# EAGLE design esparducam-v2 (EAGLE 6.5.0)
CNAME: A two component webcam; CREVISION: 2; DESIGNER: Johan Kanflo
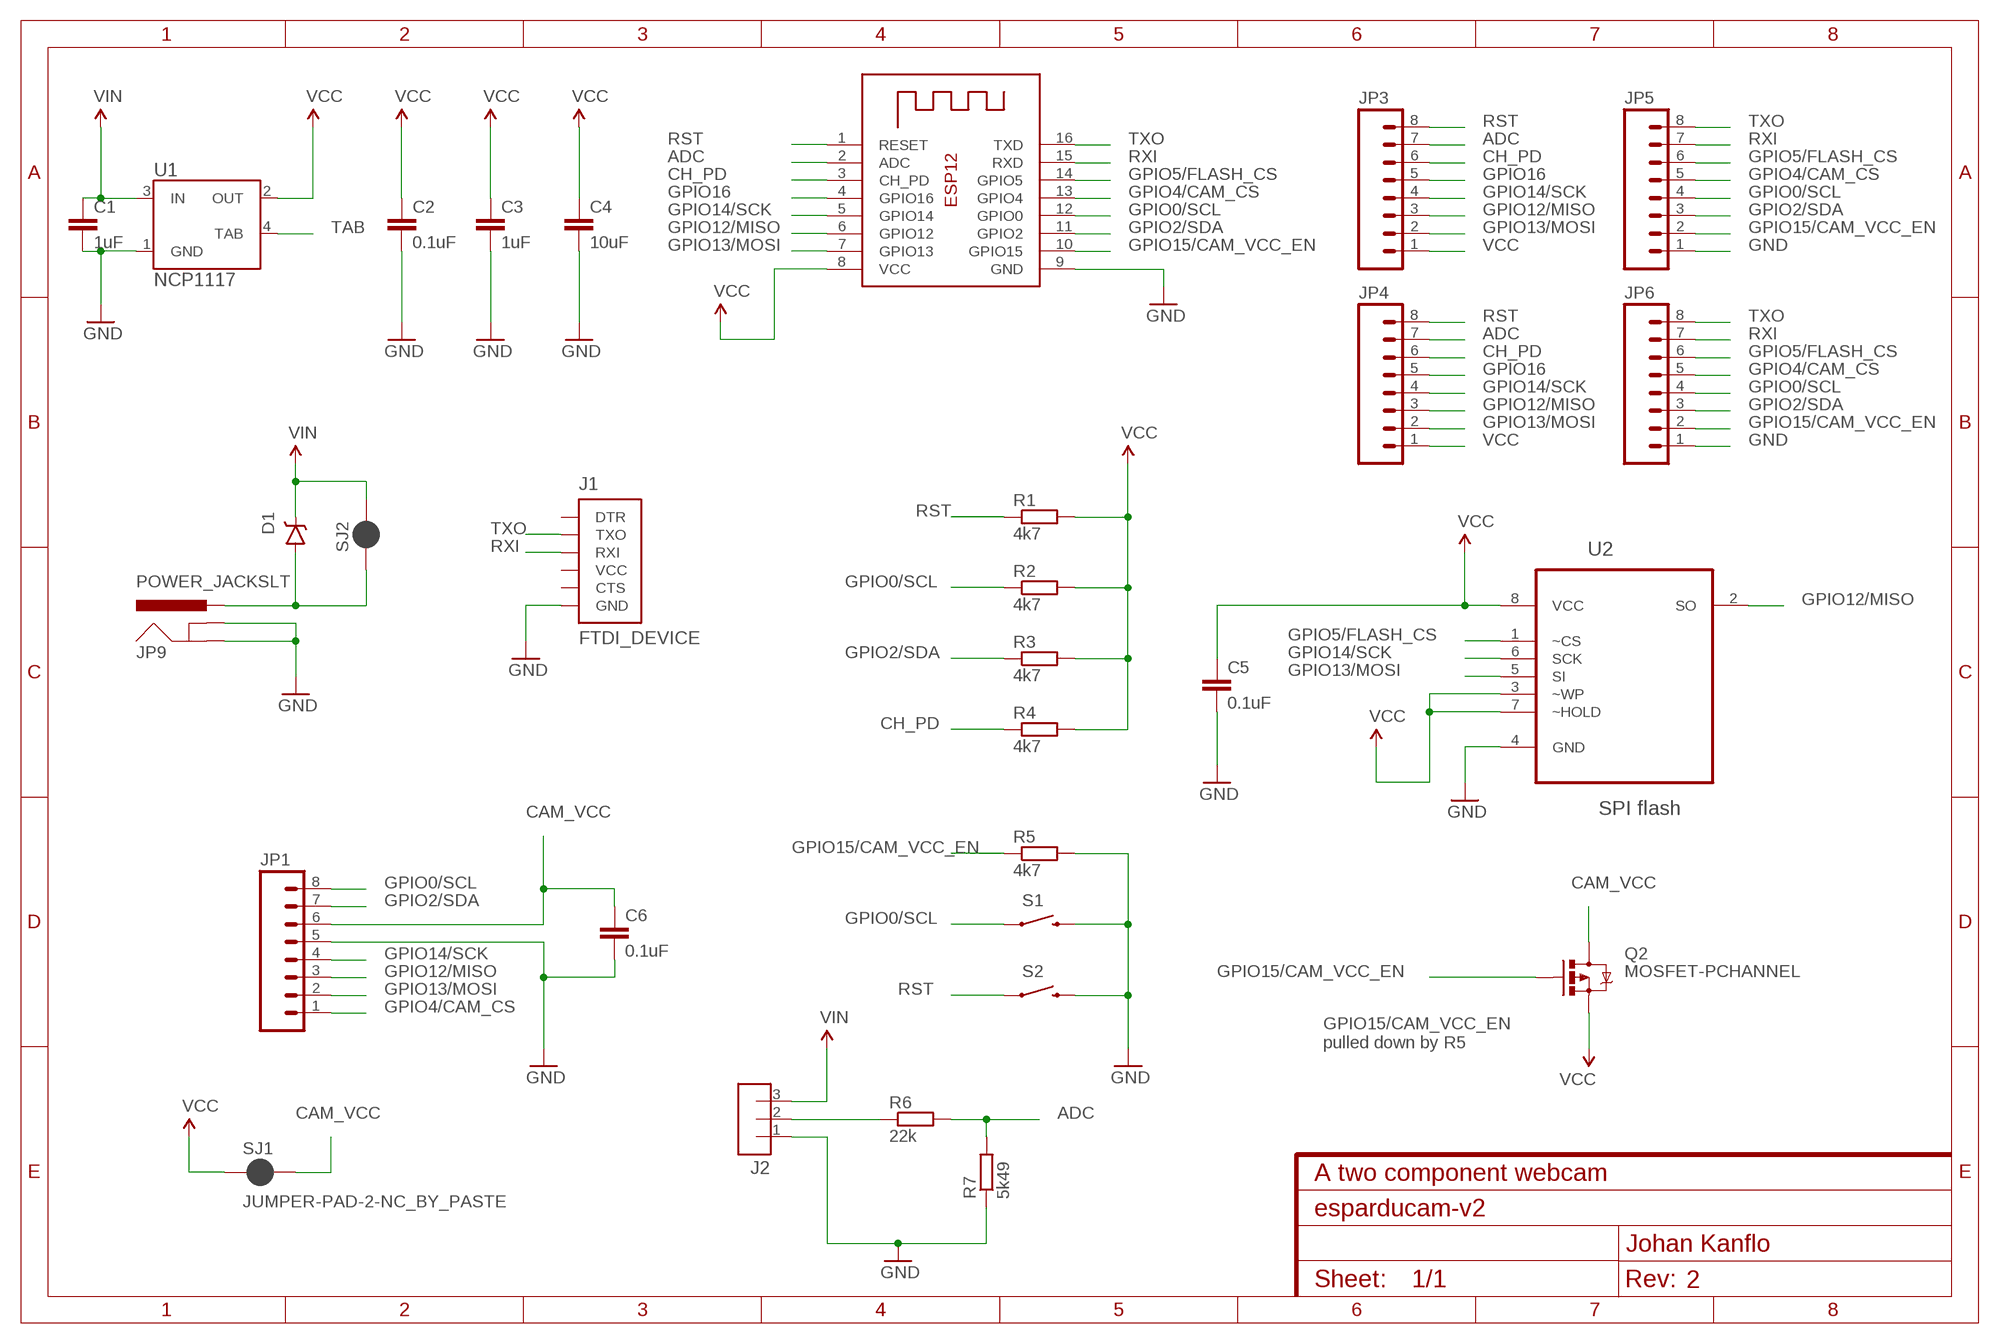
[diagram p0: schematic, sheet 1]

## Parts
C1  1uF  CAP0603-CAP  [0603-CAP]
C2  0.1uF  CAP0603-CAP  [0603-CAP]
C3  1uF  CAP0603-CAP  [0603-CAP]
C4  10uF  CAP0603-CAP  [0603-CAP]
C5  0.1uF  CAP0603-CAP  [0603-CAP]
C6  0.1uF  CAP0603-CAP  [0603-CAP]
D1  DIODE-SCHOTTKYSOD-123FL  [SOD-123FL]
J1  FTDI_DEVICE  [FTDI]
J2  JST_ZH_3PIN  [JST_ZH_3PIN]
JP1  M08  [1X08_ROUND]
JP3  M08  [1X08_ROUND]
JP4  M08  [1X08_ROUND]
JP5  M08  [1X08_ROUND]
JP6  M08  [1X08_ROUND]
JP9  POWER_JACKSLT  [POWER_JACK_SLOT]
Q2  MOSFET-PCHANNEL  [SOT23-3]
R1  4k7  R-EU_R0603  [R0603]
R2  4k7  R-EU_R0603  [R0603]
R3  4k7  R-EU_R0603  [R0603]
R4  4k7  R-EU_R0603  [R0603]
R5  4k7  R-EU_R0603  [R0603]
R6  22k  R-EU_R0603  [R0603]
R7  5k49  R-EU_R0603  [R0603]
S1  SWITCH-MOMENTARY-2SMD-1101NE  [TACTILE-SWITCH-1101NE]
S2  SWITCH-MOMENTARY-2SMD-1101NE  [TACTILE-SWITCH-1101NE]
SJ1  JUMPER-PAD-2-NC_BY_PASTE  [PAD-JUMPER-2-NC_BY_PASTE_YES_SILK]
SJ2  JUMPER-PAD-2-NC_BY_PASTE  [PAD-JUMPER-2-NC_BY_PASTE_YES_SILK]
U1  NCP1117  [SOT223]
U2  SPI flash  AT25DF021-SSH-B  [SOIC127P600X175-8N]
X1  ESP-12  [ESP-12]

## Nets
ADC: JP3.7 JP4.7 R6.2 R7.2 X1.2(ADC)
CAM_VCC: C6.1 JP1.6 Q2.3(D) SJ1.2
CH_PD: JP3.6 JP4.6 R4.1 X1.3(CH_PD)
GND: C1.2 C2.2 C3.2 C4.2 C5.2 C6.2 J1.GND J2.1 JP1.5 JP5.1 JP6.1 JP9.GND@1(GNDBREAK) JP9.GND@2(GND) R5.2 R7.1 S1.2 S2.2 U1.1(GND) U2.4(GND) X1.9(GND)
GPIO0/SCL: JP1.8 JP5.4 JP6.4 R2.1 S1.1 X1.12(GPIO0)
GPIO2/SDA: JP1.7 JP5.3 JP6.3 R3.1 X1.11(GPIO2)
GPIO4/CAM_CS: JP1.1 JP5.5 JP6.5 X1.13(GPIO4)
GPIO5/FLASH_CS: JP5.6 JP6.6 U2.1(~CS) X1.14(GPIO5)
GPIO12/MISO: JP1.3 JP3.3 JP4.3 U2.2(SO) X1.6(GPIO12)
GPIO13/MOSI: JP1.2 JP3.2 JP4.2 U2.5(SI) X1.7(GPIO13)
GPIO14/SCK: JP1.4 JP3.4 JP4.4 U2.6(SCK) X1.5(GPIO14)
GPIO15/CAM_VCC_EN: JP5.2 JP6.2 Q2.1(G) R5.1 X1.10(GPIO15)
GPIO16: JP3.5 JP4.5 X1.4(GPIO16)
N$1: J2.2 R6.1
N$2: D1.A JP9.PWR SJ2.1
RST: JP3.8 JP4.8 R1.1 S2.1 X1.1(RESET)
RXI: J1.RXI JP5.7 JP6.7 X1.15(RXD)
TAB: U1.4(TAB)
TXO: J1.TXO JP5.8 JP6.8 X1.16(TXD)
VCC: C2.1 C3.1 C4.1 C5.1 JP3.1 JP4.1 Q2.2(S) R1.2 R2.2 R3.2 R4.2 SJ1.1 U1.2(OUT) U2.3(~WP) U2.7(~HOLD) U2.8(VCC) X1.8(VCC)
VIN: C1.1 D1.C J2.3 SJ2.2 U1.3(IN)
Unconnected: J1.CTS J1.DTR J1.VCC

## Notes on the sheet
- GPIO15/CAM_VCC_EN
  pulled down by R5

## Library data of the parts
C1-C6 = SparkFun-Capacitors:CAP: Capacitor Standard 0603 ceramic capacitor, and 0.1" leaded capacitor.
D1 = kanflo:DIODE-SCHOTTKY
J1 = kanflo:FTDI_DEVICE: FTDI connector, device side This connector mates with an FTDI adapter using a straight ribbon cable.
J2 = kanflo:JST_ZH_3PIN: JST ZH connector, 3 pin ZH has 1.5mm spacing. Datasheet <http://www.jst-mfg.com/product/pdf/eng/eZH.pdf>
JP1 JP3-JP6 = SparkFun-Connectors:M08: Header 8 Standard 8-pin 0.1" header. Use with straight break away headers (SKU : PRT-00116), right angle break away headers (PRT-00553), swiss pins (PRT-00743), machine pins (PRT-00117), and female headers (PRT-00115).
JP9 = kanflo:POWER_JACK: Power Jack This is the standard 5.5mm barrel jack for power. The SLT footprint has been proven in designs produced by DirtyPCBs.com and only works if the mill layer is transmitted to the PCB fab house and the fab house accepts it. Rumours has it OSH Park accepts this design too. This symbol is meant for the cheap PCB mount connectors you find on eBay, retailing at less than 2EUR/10pcs (search for "dc power jack 5.5 2.1 pcb"). The difference between these and the ones sold by eg. SparkFun is the location of the pads relative to the plastic body.
Q2 = SparkFun-DiscreteSemi:MOSFET-PCHANNEL: Generic PMOSFET IRLML2244 - TRANS-11153 (SOT-23 -20V -4.3A) (1.Gate 2.Source 3.Drain) FQP27P06 - COM-10349 <http://www.sparkfun.com/products/10349> (TO-220 -60V -27A) (1.Gate 2.Source 3.Drain); PROD_ID: TRANS-08285
R1-R7 = resistor:R-EU_: RESISTOR, European symbol
S1 S2 = SparkFun-Electromechanical:SWITCH-MOMENTARY-2: Various NO switches- pushbuttons, reed, etc; PROD_ID: SWCH-00815
SJ1 SJ2 = SparkFun-Passives:JUMPER-PAD-2-NC_BY_PASTE
U1 = ELL-i-PowerIC:NCP1117
U2 = Atmel_By_element14_Batch_1-00:AT25DF021-SSH-B: 2-Megabit Minimum SPI Serial Flash Memory; MPN: AT25DF021-SSH-B; OC_FARNELL: 1715438; OC_NEWARK: 15R0303; PACKAGE: SOIC-8; SUPPLIER: Atmel
X1 = adafruit:ESP-12

## Board
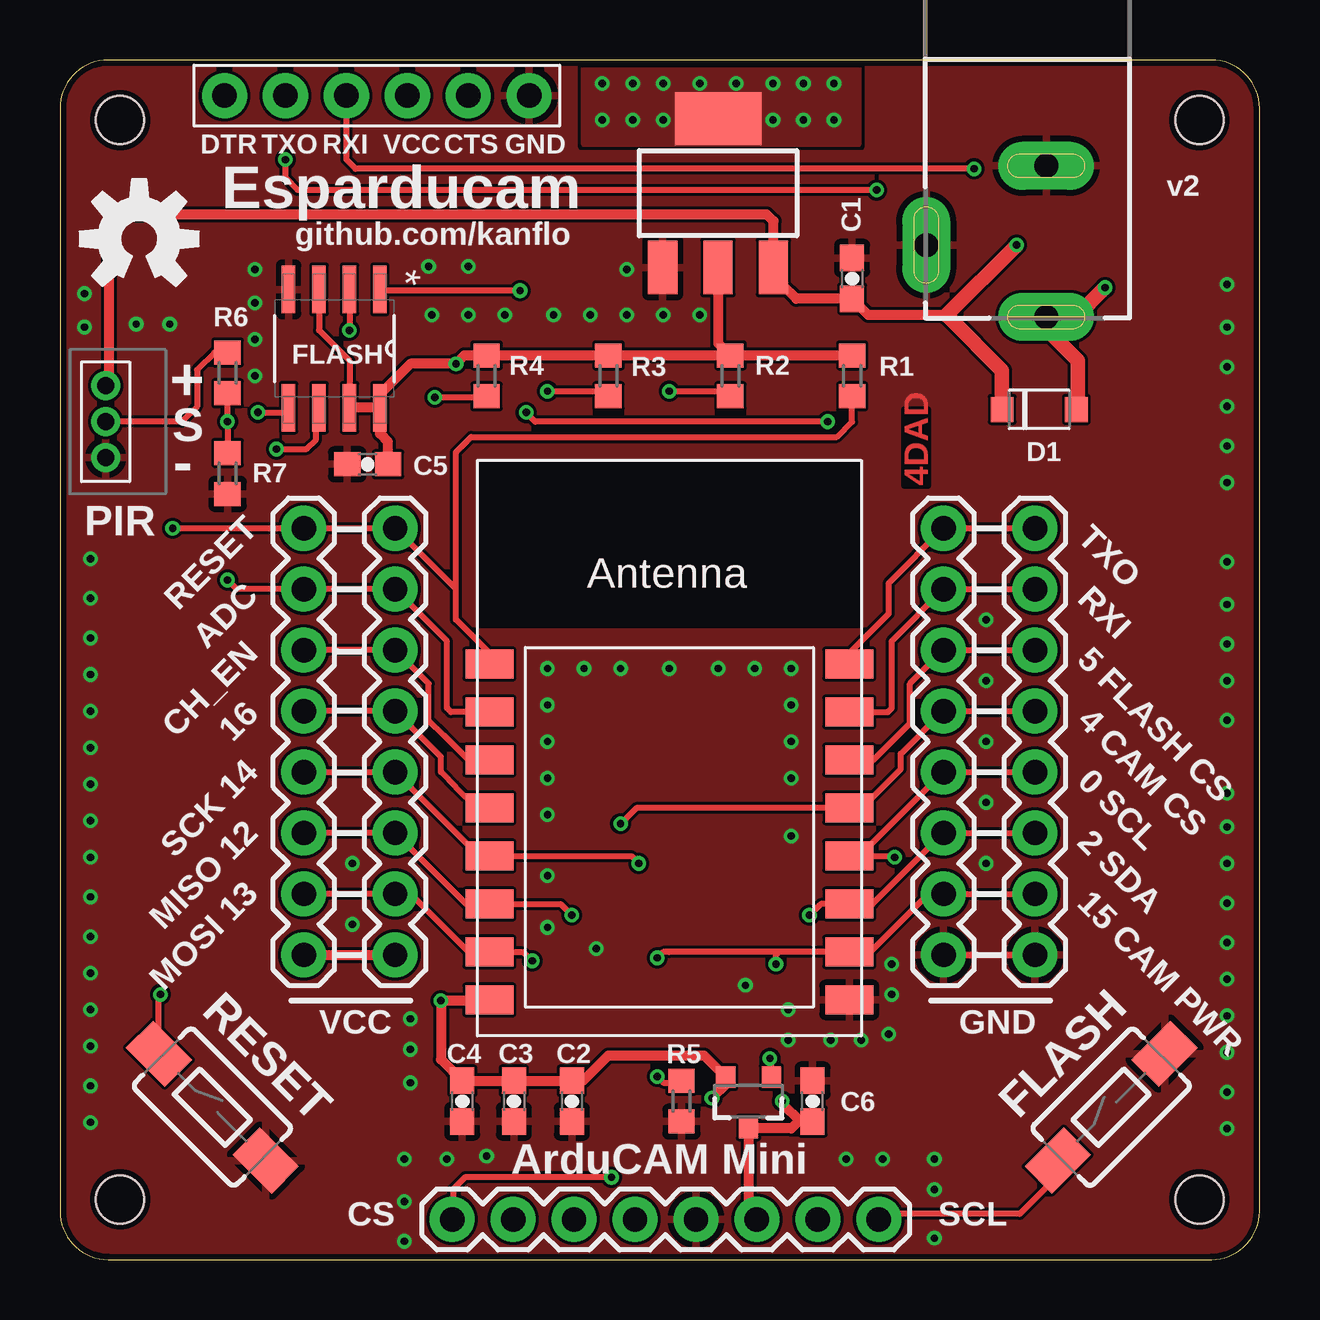
[diagram p1: board, top side]
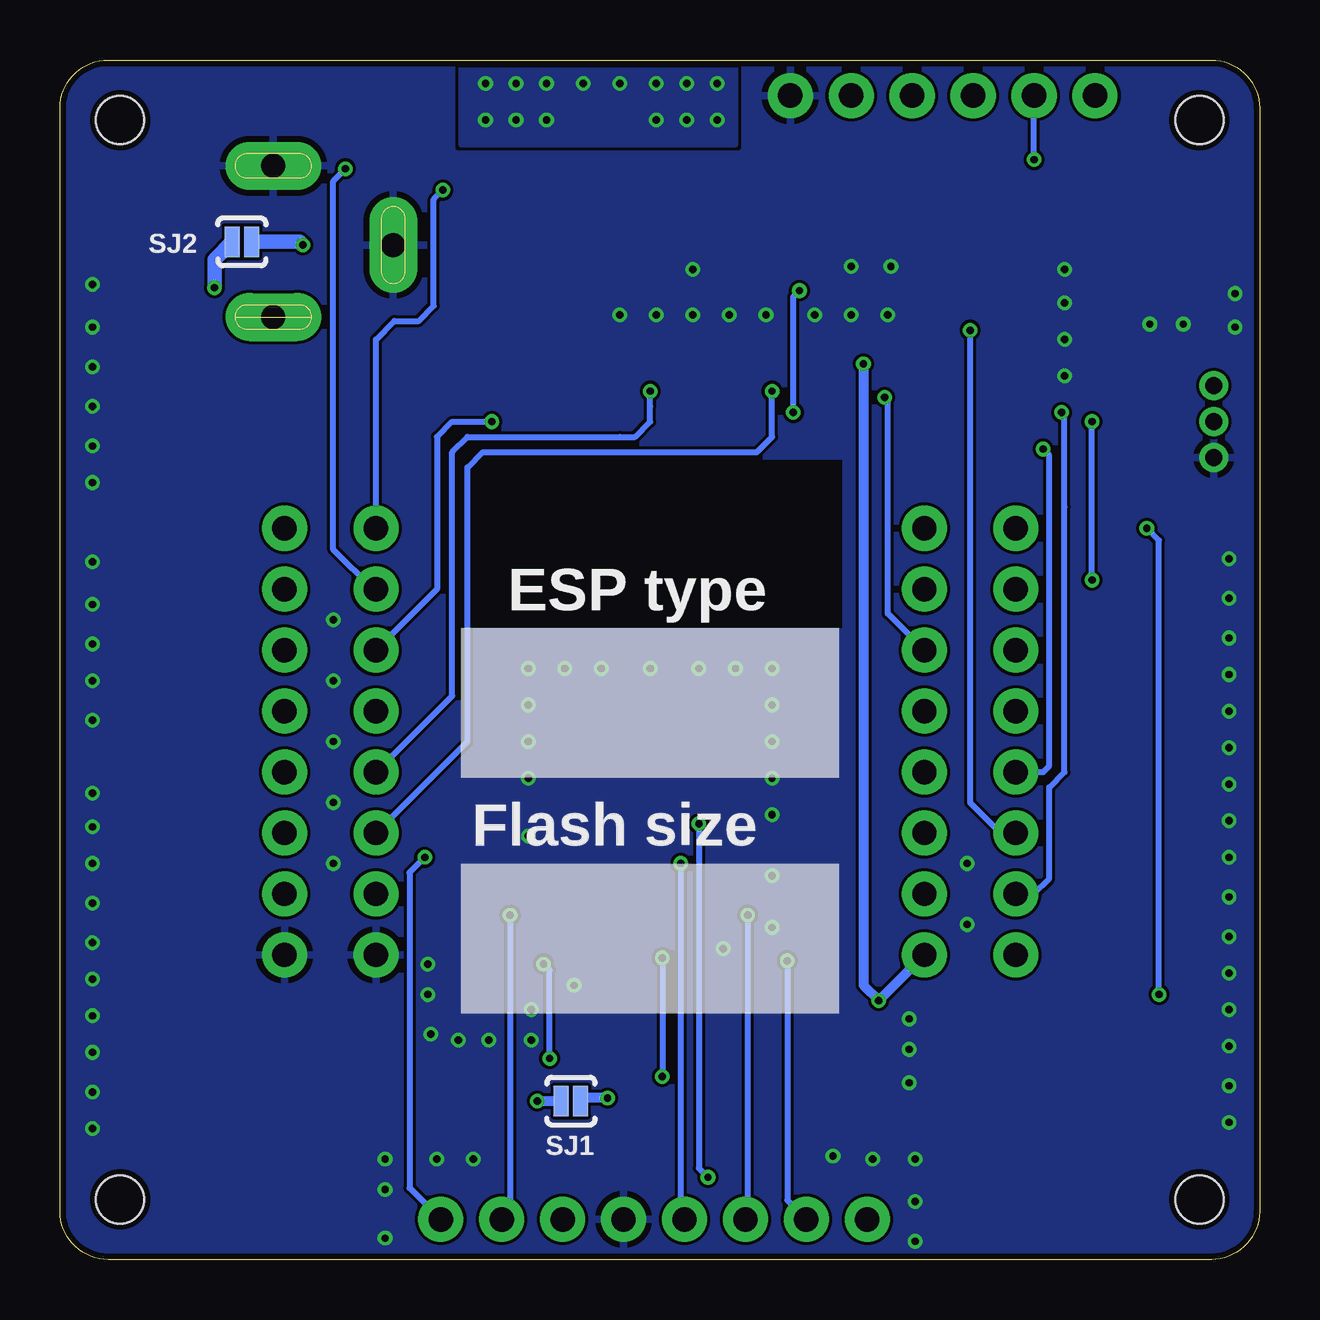
[diagram p2: board, bottom side, seen from below]

Size 50 x 50 mm. Coordinates in mm from the lower left corner, seen from the top.
Outline: 50,2 50,48 arc90 48,50 2,50 arc90 0,48 0,2 arc90 2,0 48,0 arc90 50,2
Copper layers (1*16): Top 0.035mm / dielectric 1.5mm / Bottom 0.035mm
Design rules "dirt_cheap_dirty_boards.v1": minimum track width 5mil, minimum drill 12mil, track to track 5mil, track to pad 5mil, pad to pad 5mil, via to via 5mil, smd to smd 0mil, copper to edge 10mil, drill to drill 10mil, minimum pad ring 10mil, minimum via ring 6mil, stop-mask expansion 2mil, vias tented up to drill 25mil, thermal gap 10mil
Holes 2 mm at 47.49,47.49 47.49,2.51 2.51,2.51 2.51,47.49

### Footprints (pad centres in the part's own frame; a part is rotated, then mirrored left to right if it is on the bottom)
0603-CAP = smd 1.1 x 1: 1 -0.85,0; 2 0.85,0
SOD-123FL = smd 0.95 x 1.05: A -1.6,0; C 1.5,0
FTDI = drill 1.016 pad 1.88: CTS 3.81,2.54; DTR -6.35,2.54; GND 6.35,2.54; RXI -1.27,2.54; TXO -3.81,2.54; VCC 1.27,2.54
JST_ZH_3PIN = drill 0.7 pad 1: 1 -1.5,0; 2 0,0; 3 1.5,0
1X08_ROUND = drill 1.016 pad 1.88: 1 0,0; 2 2.54,0; 3 5.08,0; 4 7.62,0; 5 10.16,0; 6 12.7,0; 7 15.24,0; 8 17.78,0
POWER_JACK_SLOT = drill 1 pad 2 long: GND@1 2.5,1.39; GND@2 -2.5,-1.91; PWR 2.5,-4.91
SOT23-3 = smd 0.8 x 0.9: 1 -0.95,-1; 2 0.95,-1; 3 0,1.1
R0603 = smd 1 x 1.1: 1 -0.85,0; 2 0.85,0
TACTILE-SWITCH-1101NE = smd 2.3 x 1.6: 1 -3.15,0; 2 3.15,0
PAD-JUMPER-2-NC_BY_PASTE_YES_SILK = smd 0.635 x 1.27: 1 -0.401,0; 2 0.413,0
SOT223 = smd 1.219 x 2.235: 1 -2.311,-3.099; 2 0,-3.099; 3 2.311,-3.099 | smd 3.6 x 2.2: 4 0,3.099
SOIC127P600X175-8N = smd 1.981 x 0.559: 1 -2.464,1.905; 2 -2.464,0.635; 3 -2.464,-0.635; 4 -2.464,-1.905; 5 2.464,-1.905; 6 2.464,-0.635; 7 2.464,0.635; 8 2.464,1.905
ESP-12 = smd 2 x 1.2: 1 -7.5,4.5; 2 -7.5,2.5; 3 -7.5,0.5; 4 -7.5,-1.5; 5 -7.5,-3.5; 6 -7.5,-5.5; 7 -7.5,-7.5; 8 -7.5,-9.5; 9 7.5,-9.5; 10 7.5,-7.5; 11 7.5,-5.5; 12 7.5,-3.5; 13 7.5,-1.5; 14 7.5,0.5; 15 7.5,2.5; 16 7.5,4.5

### Placement (x,y rotation side)
C1  33.02,40.89 90 top
C2  21.34,6.6 270 top
C3  18.92,6.6 270 top
C4  16.76,6.6 270 top
C5  12.83,33.15 180 top
C6  31.37,6.6 90 top
D1  40.77,35.43 180 top
J1  13.21,45.97 0 top
J2  1.91,34.92 90 top
JP1  16.35,1.67 0 top
JP3  10.16,12.7 90 top
JP4  13.97,12.7 90 top
JP5  36.83,12.7 90 top
JP6  40.64,12.7 90 top
JP9  38.61,44.2 0 top
Q2  28.7,6.6 180 top
R1  33.02,36.83 90 top
R2  27.94,36.83 90 top
R3  22.86,36.83 90 top
R4  17.78,36.83 90 top
R5  25.91,6.6 270 top
R6  6.99,36.96 270 top
R7  6.99,32.77 90 top
S1  43.81,6.35 45 top
S2  6.35,6.35 315 top
SJ1  28.7,6.6 180 bottom
SJ2  42.42,42.42 0 bottom
U1  27.43,44.45 0 top
U2  11.43,37.97 270 top
U$1  [OSHW-LOGO-M]  3.3,42.55 0 top
X1  25.4,20.32 0 top

### Tracks (layer width: path | path; a pad name or v marks a point on that pad's centre or on a via)
ADC  (via drill 0.3 pad 0.25)
  Top 0.254: X1.2 16.3,22.82 16.13,22.99 16.13,25.78 JP4.7 JP3.7 7.37,27.94 v6.99,28.32 | R6.2 v6.99,34.92 R7.2
  Bottom 0.254: v6.99,28.32 v6.99,34.92
CAM_VCC  (via drill 0.3 pad 0.25)
  Top 0.406: JP1.6 28.7,2.02 Q2.3 28.75,5.46 30.48,5.46 30.77,5.75 30.86,5.75 | C6.1 30.86,5.75 | v30.1,6.6 30.1,6.52 30.86,5.75
  Bottom 0.406: SJ1.2 v30.1,6.6
CH_PD  (via drill 0.3 pad 0.25)
  Top 0.254: JP3.6 JP4.6 15.37,24 15.37,22.48 16,21.84 17.03,20.82 X1.3 | v15.62,35.94 17.74,35.94 R4.1
  Bottom 0.254: JP4.6 15.49,26.92 15.49,35.81 v15.62,35.94
GND  (via drill 0.3 pad 0.25)
  Top 0.254: JP5.1 JP6.1
  other vias: 14.35,0.76 23.62,41.27 14.35,4.19 16.13,4.19 17.78,4.32 14.35,2.41 36.45,2.92 32.77,4.19 34.29,4.19 48.64,40.64 36.45,4.19 36.45,0.89 20.32,13.84 20.32,16 14.61,10.03 17.02,39.37 30.48,17.65 20.32,18.54 20.32,20.07 20.32,21.59 20.32,23.11 20.32,24.64 12.19,16.51 12.19,13.97 14.61,7.37 22.35,12.95 1.02,40.26 14.61,8.76 25.15,39.37 15.37,41.4 30.48,20.07 30.48,21.59 30.48,23.11 30.48,24.64 18.54,39.37 20.57,39.37 28.96,24.64 21.84,24.64 23.62,39.37 23.37,24.64 25.4,24.64 27.43,24.64 22.1,39.37 8.13,39.88 15.49,39.37 8.13,38.35 8.13,36.83 4.57,38.99 38.61,26.67 38.61,24.13 38.61,21.59 38.61,19.05 38.61,16.51 26.67,39.37 17.02,41.4 1.02,38.86 8.13,41.27 1.27,29.21 1.27,27.56 1.27,25.91 1.27,24.38 1.27,22.86 3.17,38.99 1.27,21.34 1.27,19.81 1.27,18.29 1.27,16.76 1.27,5.71 1.27,15.11 1.27,13.46 1.27,11.94 1.27,10.41 1.27,8.89 1.27,7.24 48.64,32.38 48.64,38.86 48.64,33.91 48.64,29.08 48.64,27.3 48.64,25.65 48.64,24.13 48.64,22.48 48.64,35.56 48.64,37.21 48.64,19.43 48.64,18.03 48.64,16.51 48.64,5.46 48.64,14.86 48.64,13.21 48.64,11.68 48.64,10.16 48.64,8.64 48.64,6.99 34.67,11.05 34.54,9.4 28.57,11.43 30.35,10.41 34.67,12.32 30.35,9.14 32.13,9.14 33.4,9.14
  pour Top (rank 6): 0,48.04 0,2 arc90 2,0 48.04,0 arc90 50.04,2 50.04,48.04 arc90 48.04,50.04 2,50.04 arc90
  pour Bottom (rank 6): 0,48.04 0,2 arc90 2,0 48.04,0 arc90 50.04,2 50.04,48.04 arc90 48.04,50.04 2,50.04 arc90
GPIO0/SCL  (via drill 0.3 pad 0.25)
  Top 0.254: X1.12 33.33,16.82 | 33.33,16.82 JP5.4 JP6.4 | S1.1 41.59,3.49 40.01,1.91 34.15,1.91 JP1.8 | v25.4,36.2 27.73,36.2 R2.1 | 33.33,16.82 34.74,16.82 v34.8,16.76
  Bottom 0.254: JP5.4 34.29,22.86 33.66,23.5 33.66,33.66 33.02,34.29 26.67,34.29 26.04,34.29 25.4,34.92 25.4,35.56 v25.4,36.2 | v34.8,16.76 35.43,16.13 35.43,2.98 JP1.8
GPIO2/SDA  (via drill 0.3 pad 0.25)
  Top 0.254: JP6.3 JP5.3 33.87,14.82 X1.11 31.71,14.82 v31.24,14.35 | v20.32,36.2 22.64,36.2 R3.1
  Bottom 0.254: JP5.3 33.02,21.59 33.02,33.02 32.38,33.66 20.95,33.66 20.32,34.29 v20.32,36.2 | v31.24,14.35 31.24,2.02 JP1.7
GPIO4/CAM_CS  (via drill 0.3 pad 0.25)
  Top 0.254: JP6.5 JP5.5 35.05,21.08 35.05,20.45 33.42,18.82 X1.13 24.03,18.82 v23.37,18.16 | v22.99,3.43 16.89,3.43 16.38,2.92 16.38,1.71 JP1.1
  Bottom 0.254: v23.37,18.16 23.37,3.81 v22.99,3.43
GPIO5/FLASH_CS  (via drill 0.3 pad 0.25)
  Top 0.254: JP6.6 JP5.6 35.43,24 35.43,22.35 33.9,20.82 X1.14 | v32,34.92 19.81,34.92 v19.43,35.31 | v19.18,40.39 13.39,40.39 U2.1
  Bottom 0.254: JP5.6 34.29,27.94 34.29,34.29 33.66,34.92 v32,34.92 | v19.43,35.31 19.43,40.13 v19.18,40.39
GPIO12/MISO  (via drill 0.3 pad 0.25)
  Top 0.254: JP3.3 JP4.3 16.93,14.82 X1.6 20.87,14.82 v21.34,14.35 | U2.2 v12.06,38.73
  Bottom 0.254: v12.06,38.73 12.06,19.05 10.79,17.78 JP3.3 | v21.34,14.35 21.34,1.77 JP1.3
GPIO13/MOSI  (via drill 0.3 pad 0.25)
  Top 0.254: JP3.2 JP4.2 14.61,15.24 17.02,12.82 X1.7 19.31,12.82 v19.68,12.45 | v8.26,35.31 9.32,35.31 U2.5
  Bottom 0.254: JP3.2 9.4,15.24 8.76,15.88 8.76,19.68 8.13,20.32 8.13,31.37 8.13,35.18 v8.26,35.31 | v19.68,12.45 19.68,2.47 JP1.2
GPIO14/SCK  (via drill 0.3 pad 0.25)
  Top 0.254: JP3.4 JP4.4 17.47,16.82 X1.5 23.82,16.82 v24.13,16.51 | 10.67,35.38 U2.6 10.67,35.38 | v9.02,33.78 10.29,33.78 10.67,34.16 10.67,35.38
  Bottom 0.254: v24.13,16.51 24.13,2.09 JP1.4 | JP3.4 9.02,20.32 8.76,20.57 8.76,31.11 8.76,33.53 v9.02,33.78
GPIO15/CAM_VCC_EN  (via drill 0.3 pad 0.25)
  Top 0.254: JP6.2 JP5.2 36.2,15.24 33.77,12.82 X1.10 29.97,12.82 | 29.97,12.82 25.39,12.82 25.14,12.82 v24.89,12.57 | v24.89,7.62 25.15,7.37 25.82,7.37 R5.1 | Q2.1 29.65,8.32 v29.59,8.38 | v29.84,12.32 29.84,12.69 29.97,12.82
  Bottom 0.254: v24.89,12.57 v24.89,7.62 | v29.59,8.38 29.59,12.06 v29.84,12.32
GPIO16
  Top 0.254: X1.4 17.38,18.82 16.51,19.68 15.88,20.32 15.88,20.95 JP4.5 JP3.5
N$1
  Top 0.254: R6.1 6.44,37.81 5.71,37.08 5.71,35.56 5.08,34.92 J2.2
N$2  (via drill 0.3 pad 0.25)
  Top 0.61: D1.A 42.42,35.48 42.42,37.47 41.11,38.77 JP9.PWR 42.33,39.29 v43.56,40.51
  Bottom 0.61: v43.56,40.51 43.56,41.68 SJ2.1
RST  (via drill 0.3 pad 0.25)
  Top 0.254: X1.1 17.9,25.28 16.51,26.67 16.51,27.3 16.51,27.94 | 16.51,27.94 JP4.8 10.67,30.48 | 16.51,27.94 16.51,33.66 17.14,34.29 32.38,34.29 33.02,34.92 R1.1 | JP3.8 10.67,30.48 | S2.1 4.12,10.98 v4.19,11.05 | v4.7,30.48 10.67,30.48
  Bottom 0.254: v4.19,11.05 4.19,29.97 v4.7,30.48
RXI  (via drill 0.3 pad 0.25)
  Top 0.254: JP6.7 JP5.7 34.67,25.78 34.67,22.99 34.5,22.82 X1.15 | v38.1,45.47 12.32,45.47 11.94,45.85 J1.RXI
  Bottom 0.254: JP5.7 36.96,27.94 38.61,29.59 38.61,44.96 v38.1,45.47
TAB  (via drill 0.3 pad 0.25)
  other vias: 22.61,49.02 22.61,47.5 23.88,49.02 23.88,47.5 30.99,49.02 30.99,47.5 32.26,49.02 32.26,47.5 29.72,49.02 29.72,47.5 25.15,49.02 25.15,47.5 26.67,49.02 28.19,49.02
  pour Top (isolate 0.305, no thermals): 21.84,50.04 33.27,50.04 33.27,46.48 21.84,46.48
  pour Bottom (isolate 0.305, no thermals): 21.84,50.04 33.27,50.04 33.27,46.48 21.84,46.48
TXO  (via drill 0.3 pad 0.25)
  Top 0.254: X1.16 32.9,25.28 34.54,26.92 34.54,28.19 JP5.8 JP6.8 | v34.04,44.58 9.91,44.58 9.4,45.09 v9.4,45.85
  Bottom 0.254: JP5.8 36.83,38.35 36.07,39.12 35.05,39.12 34.42,39.75 34.42,44.2 v34.04,44.58 | v9.4,45.85 J1.TXO
VCC  (via drill 0.3 pad 0.25)
  Top 0.254: 12.06,34.92 U2.7 12.06,37.47 10.79,38.73 U2.3
  Top 0.406: U2.8 U2.7 | U1.2 27.43,38.19 R2.2 | R1.2 R2.2 | R2.2 R3.2 R4.2 16.85,37.68 v16.51,37.34 14.61,37.34 13.34,36.07 U2.8 | X1.8 17.88,10.79 v15.88,10.79 15.88,8.34 C4.1 C3.1 C2.1 21.8,7.45 22.86,8.51 26.85,8.51 Q2.2 27.75,7.3 v27.18,6.73 | JP3.1 JP4.1 | C5.1 13.68,34.08 13.34,34.42 U2.8
  Bottom 0.406: v16.51,37.34 16.51,11.43 v15.88,10.79 JP4.1 | v27.18,6.73 28.17,6.73 SJ1.1
VIN  (via drill 0.3 pad 0.25)
  Top 0.406: 36.96,39.37 33.69,39.37 C1.1 30.7,40.04 30.1,40.64 30.1,40.74 U1.3 29.74,43.28 29.46,43.56 2.54,43.56 2.03,43.05 2.03,36.55 J2.3
  Top 0.61: D1.C 39.27,37.06 37.08,39.24 36.96,39.37 v39.88,42.29
  Bottom 0.61: SJ2.2 40.01,42.42 v39.88,42.29

### Text on the board
Top: 4DAD
tNames: v2 | Esparducam | C1 | github.com/kanflo | R6 | FLASH | R4 | R3 | R2 | R1 | + | S | C5 | - | R7 | RESET | TXO | PIR | ADC | RXI | CH_EN | 5 FLASH CS | 16 | 4 CAM CS | SCK 14 | 0 SCL | MISO 12 | 2 SDA | MOSI 13 | 15 CAM PWR | VCC | GND | C4 | C3 | C2 | R5 | RESET | C6 | FLASH | ArduCAM Mini | CS | SCL
bNames: SJ2 | ESP type | Flash size | SJ1